# Altium schematic sheet Clocks_gen.SchDoc
size A4
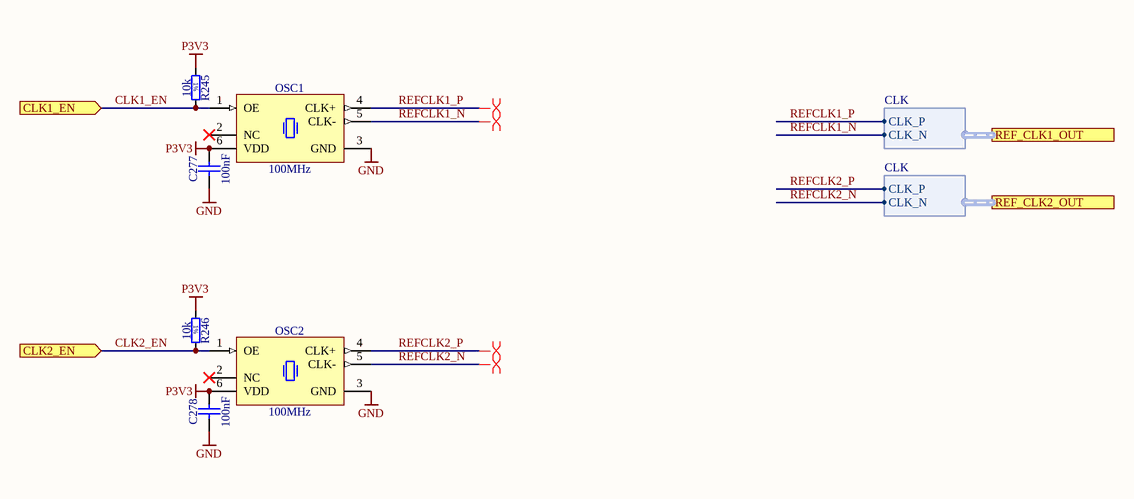
[diagram p0: Clocks_gen.SchDoc]

## Parts
C277  100nF  [CAPC1005X55N]
C278  100nF  [CAPC1005X55N]
OSC1  100MHz  [OSC_SILICON-LAB_SI531]
OSC2  100MHz  [OSC_SILICON-LAB_SI531]
R245  10k  [RESC1005X40N]
R246  10k  [RESC1005X40N]

## Ports
CLK1_EN (in), CLK2_EN (in), REF_CLK1_OUT (harness CLK), REF_CLK2_OUT (harness CLK)

## Harnesses
CLK: CLK_P, CLK_N

## Nets
GND: C277.1 C278.1 OSC1.3(GND) OSC2.3(GND)
P3V3: C277.2 C278.2 OSC1.6(VDD) OSC2.6(VDD) R245.1 R246.1
CLK1_EN: OSC1.1(OE) R245.2 ; port CLK1_EN
CLK2_EN: OSC2.1(OE) R246.2 ; port CLK2_EN
REFCLK1_N: OSC1.5(CLK-) ; port REF_CLK1_OUT.CLK_N
REFCLK1_P: OSC1.4(CLK+) ; port REF_CLK1_OUT.CLK_P
REFCLK2_N: OSC2.5(CLK-) ; port REF_CLK2_OUT.CLK_N
REFCLK2_P: OSC2.4(CLK+) ; port REF_CLK2_OUT.CLK_P

Not connected (* = marked no-connect by the designer): OSC1 2(NC)*; OSC2 2(NC)*

## Layout directives
differential pair: REFCLK1_N, REFCLK1_P, REFCLK2_N, REFCLK2_P

## Notes on the sheet
- (in symbol R0402_10K_1%_0.0625W_100PPM) 1%

## Library data of the parts
C277 C278 = CC0402_100NF_25V_10%_X7R_YUDEN_TMK105B7104KVHF: Non-polarised capacitor; Part Description: SMD Multilayer Chip Ceramic Capacitor (High Dielectric Type) for Automotive / Industrial Applications; Manufacturer: TAIYO YUDEN; Voltage: 25V; TC: X7R; Tolerance: ±10%; Part Number: CC0402_100NF_25V_10%_X7R_YUDEN_TMK105B7104KVHF; Component Kind: Standard; Component Type: Standard; Pin Count: 2; Value: 100nF; Status: Not Recommended; Manufacturer Part Number: TMK105B7104KVHF; Case: 0402; Mounted: Yes; Socket: No; SMD: Yes; Sense: No; HelpURL: \\cern.ch\dfs\Applications\Altium\Datasheets\CC0402_TAIYO-YUDEN_TMK105B7104KVHF.pdf; Author: CERN DEM JLC; CreateDate: 10.05.2017; LatestRevisionDate: 10.05.2017; ComponentHeight: 0.55mm
OSC1 OSC2 = OSC_100MHZ_SILICON-LAB_531BC100M000DG: 10-1400MHz, Crystal Oscillator (XO), Si531 Series; Part Description: 3.3V ±20ppm LVDS Crystal Oscillator (XO), Si531 Series; Manufacturer: SILICON LABS; PressFit: No; Bonding: No; Part Number: OSC_100MHZ_SILICON-LAB_531BC100M000DG; Component Kind: Standard; Component Type: Standard; PackageDescription: Oscillator Si531 Series, 6 pins, 5x7mm; Value: 100MHz; Manufacturer Part Number: 531BC100M000DG; Pin Count: 6; Mounted: Yes; Socket: No; SMD: Yes; Sense: No; ComponentHeight: 1.8mm; HelpURL: \\cern.ch\dfs\Applications\Altium\Datasheets\OSC_SILICON-LAB_SI531.pdf; Author: CERN DEM MR; CreateDate: 2017-06-30; LatestRevisionDate: 2017-06-30
R245 R246 = R0402_10K_1%_0.0625W_100PPM: Resistor - 1%; Part Description: General Purpose Thick Film Chip Resistor; Manufacturer: GENERIC; Manufacturer1 Part Number: 232270671003L; TC: ±100ppm/°C; PressFit: No; Part Number: R0402_10K_1%_0.0625W_100PPM; Component Kind: Standard; Component Type: Standard; Pin Count: 2; Value: 10k; Status: Not Recommended; Power: 0.0625W; Tolerance: ±1%; Manufacturer Part Number: R0402_10K_1%_0.0625W_100PPM; Case: 0402; Mounted: Yes; Sense: No; Socket: No; SMD: Yes; Manufacturer1 Example: YAGEO PHYCOMP; Manufacturer1 ComponentHeight: 0.4mm; HelpURL: \\cern.ch\dfs\Applications\Altium\Datasheets\R0402_Phycomp_RC0402.pdf; Author: CERN DEM JLC; CreateDate: 03/12/2007; LatestRevisionDate: 17/10/2012